# Altium schematic sheet POWER_VOLTAGE.SchDoc
size B
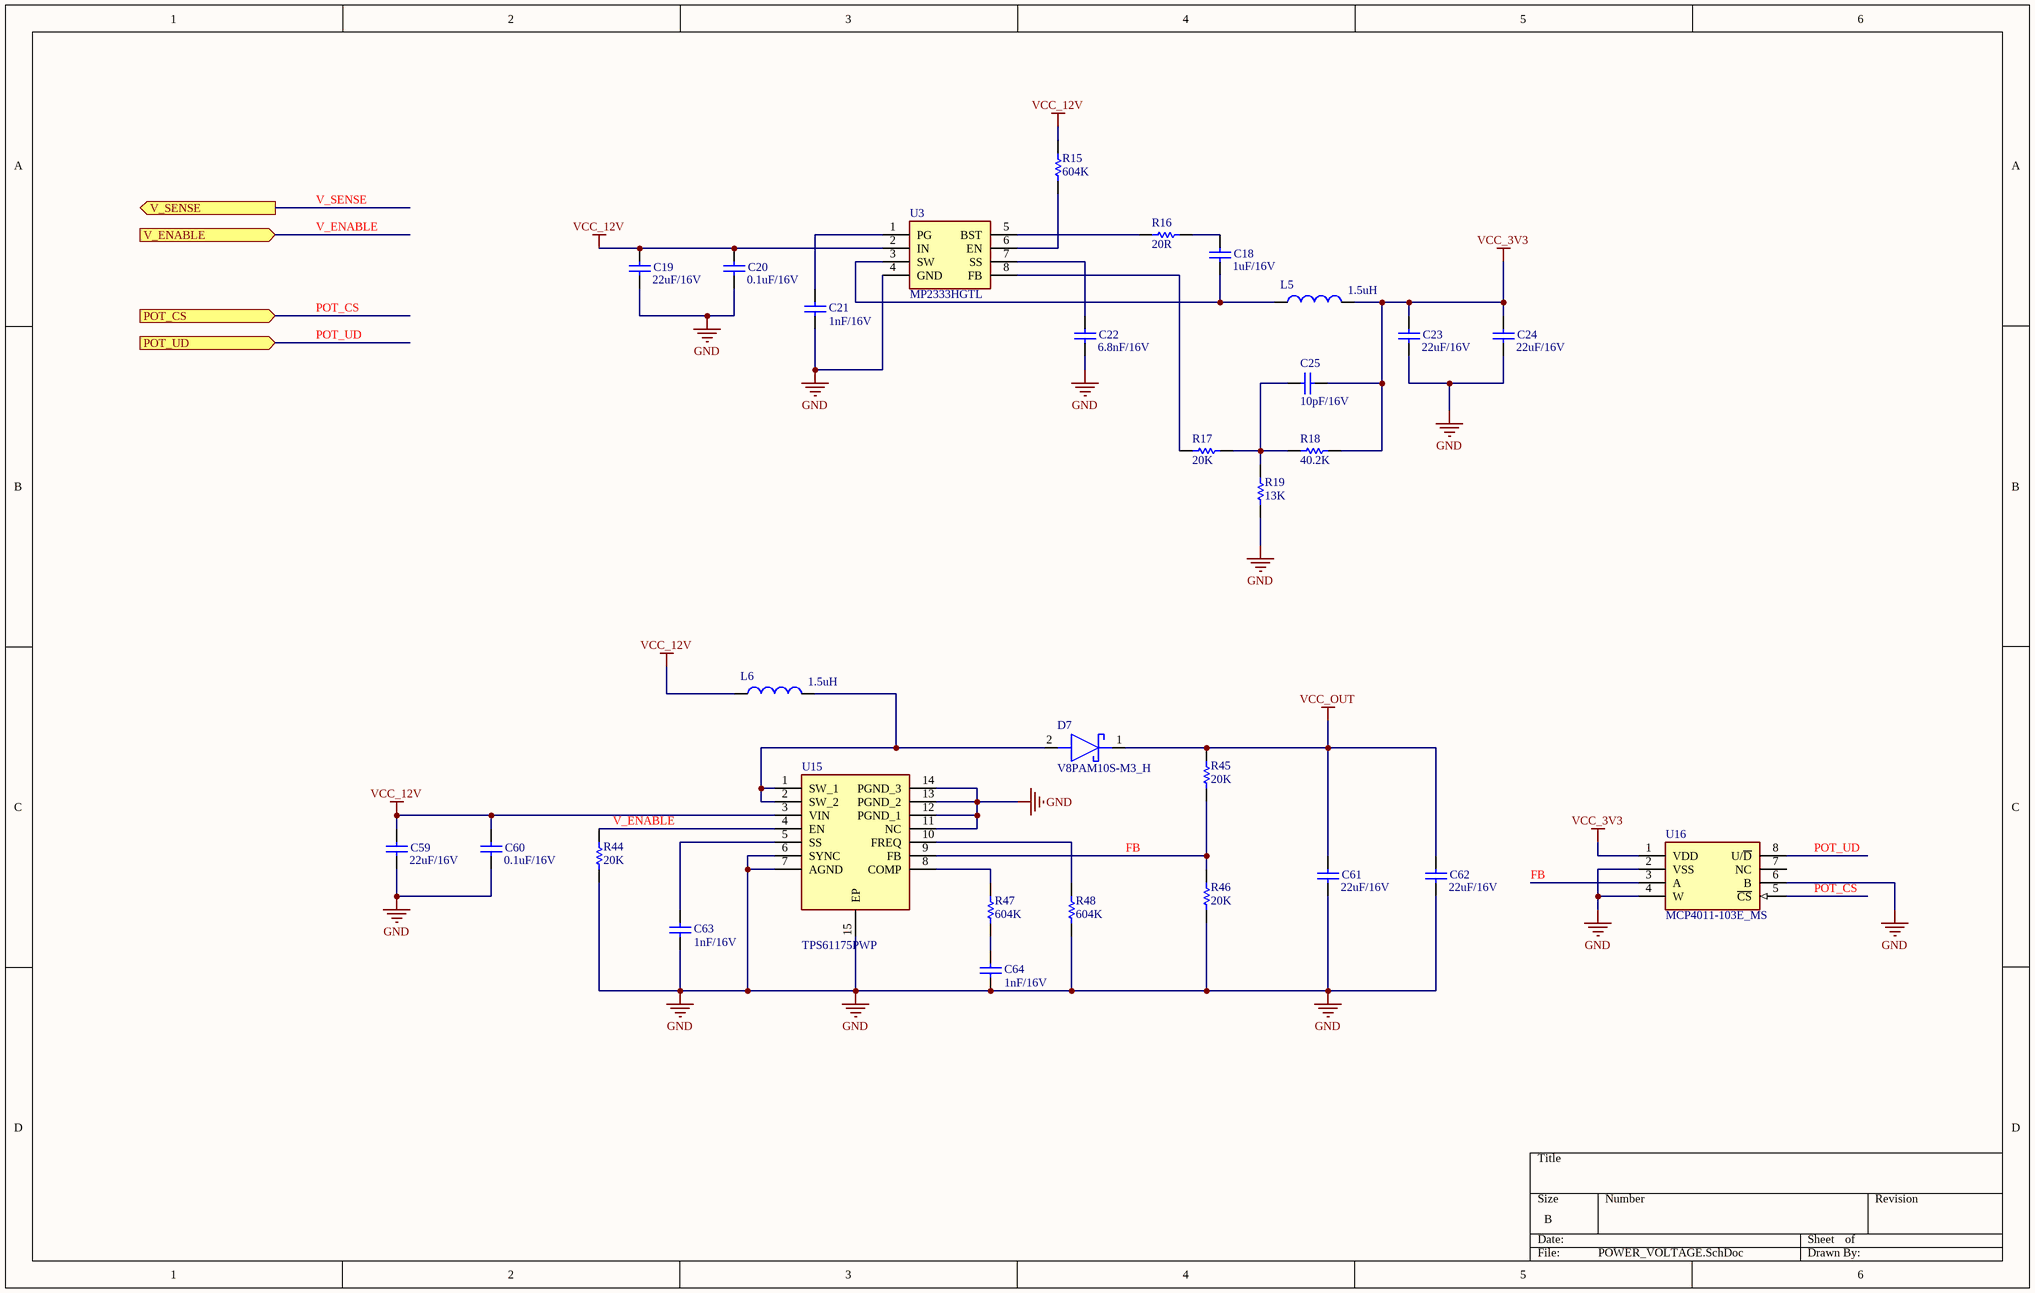
[diagram p0: POWER_VOLTAGE.SchDoc]

## Parts
C18  1uF/16V  [RAD-0.3]
C19  22uF/16V  [RAD-0.3]
C20  0.1uF/16V  [RAD-0.3]
C21  1nF/16V  [RAD-0.3]
C22  6.8nF/16V  [RAD-0.3]
C23  22uF/16V  [RAD-0.3]
C24  22uF/16V  [RAD-0.3]
C25  10pF/16V  [RAD-0.3]
C59  22uF/16V  [RAD-0.3]
C60  0.1uF/16V  [RAD-0.3]
C61  22uF/16V  [RAD-0.3]
C62  22uF/16V  [RAD-0.3]
C63  1nF/16V  [RAD-0.3]
C64  1nF/16V  [RAD-0.3]
D7  V8PAM10S-M3_H  [V8PAM10SHM3H]
L5  1.5uH
L6  1.5uH
R15  604K  [AXIAL-0.3]
R16  20R  [AXIAL-0.3]
R17  20K  [AXIAL-0.3]
R18  40.2K  [AXIAL-0.3]
R19  13K  [AXIAL-0.3]
R44  20K  [AXIAL-0.3]
R45  20K  [AXIAL-0.3]
R46  20K  [AXIAL-0.3]
R47  604K  [AXIAL-0.3]
R48  604K  [AXIAL-0.3]
U3  MP2333HGTL  [SOTFL50P160X60-8N]
U15  TPS61175PWP  [SOP65P640X120-15N]
U16  MCP4011-103E_MS  [SOP65P490X110-8N]

## Ports
POT_CS (in), POT_UD (in), V_ENABLE (in), V_SENSE (out)

## Nets
GND: C19.1 C20.1 C21.1 C22.1 C23.1 C24.1 C59.1 C60.1 C61.1 C62.1 C63.1 C64.1 R19.2 R44.2 R46.2 R48.1 U3.4(GND) U15.6(SYNC) U15.7(AGND) U15.11(NC) U15.12(PGND_1) U15.13(PGND_2) U15.14(PGND_3) U15.15(EP) U16.2(VSS) U16.4(W) U16.6(B)
VCC_3V3: C23.2 C24.2 C25.1 L5.2 R18.2 U16.1(VDD)
VCC_12V: C19.2 C20.2 C59.2 C60.2 L6.1 R15.2 U3.2(IN) U15.3(VIN)
VCC_OUT: C61.2 C62.2 D7.1(K) R45.1
FB: R45.2 R46.1 U15.9(FB) U16.3(A)
POT_CS: U16.5(~{CS}) ; port POT_CS
POT_UD: U16.8(U/~{D}) ; port POT_UD
V_ENABLE: R44.1 U15.4(EN) ; port V_ENABLE
V_SENSE: port V_SENSE
NetC18_1: C18.1 L5.1 U3.3(SW)
NetC18_2: C18.2 R16.2
NetC21_2: C21.2 U3.1(PG)
NetC22_2: C22.2 U3.7(SS)
NetC25_2: C25.2 R17.1 R18.1 R19.1
NetC63_2: C63.2 U15.5(SS)
NetC64_2: C64.2 R47.1
NetD7_2: D7.2(A) L6.2 U15.1(SW_1) U15.2(SW_2)
NetR15_1: R15.1 U3.6(EN)
NetR16_1: R16.1 U3.5(BST)
NetR17_2: R17.2 U3.8(FB)
NetR47_2: R47.2 U15.8(COMP)
NetR48_2: R48.2 U15.10(FREQ)

Not connected (* = marked no-connect by the designer): U16 7(NC)

## Library data of the parts
C18-C25 C59-C64 = Cap: Capacitor; Published: 8-Jun-2000; LatestRevisionDate: 17-Jul-2002; LatestRevisionNote: Re-released for DXP Platform.; PackageReference: RAD-0.3; Publisher: Altium Limited; PackageDescription: Radial Cap, Thru-Hole; 2 Leads; 0.3 in Pin Spacing
  C18: Value: 1uF/16V
  C19 C23 C24 C59 C61 C62: Value: 22uF/16V
  C20 C60: Value: 0.1uF/16V
  C21 C63 C64: Value: 1nF/16V
  C22: Value: 6.8nF/16V
  C25: Value: 10pF/16V
D7 = V8PAM10S-M3_H: Schottky Diode; Manufacturer_Name: Vishay; Manufacturer_Part_Number: V8PAM10S-M3/H; Datasheet Link: https://www.vishay.com/docs/87013/v8pam10s.pdf; Height: 1mm; Mouser Part Number: 78-V8PAM10S-M3/H; Mouser Price/Stock: https://www.mouser.co.uk/ProductDetail/Vishay-General-Semiconductor/V8PAM10S-M3-H?qs=7MVldsJ5Uazp%2FkF6tV7Ktw%3D%3D
L5 L6 = INDUCTOR: Fixed Inductors .33uH 20%; Manufacturer: Vishay; Mfr Part No: IHLP1212ABEVR33M5A; Stockiest Part No: 70-IHLP1212ABVR33M5A; Value: 1.5uH; Stockiest: MOUSER
R15-R19 R44-R48 = Res1: Resistor; Published: 8-Jun-2000; LatestRevisionDate: 17-Jul-2002; LatestRevisionNote: Re-released for DXP Platform.; PackageReference: AXIAL-0.3; Publisher: Altium Limited; PackageDescription: Axial Device, Thru-Hole; 2 Leads; 0.3 in Pin Spacing
  R15 R47 R48: Value: 604K
  R16: Value: 20R
  R17 R44-R46: Value: 20K
  R18: Value: 40.2K
  R19: Value: 13K
U3 = MP2333HGTL: Integrated Circuit; Manufacturer_Name: Monolithic Power Systems (MPS); Datasheet Link: https://4donline.ihs.com/images/VipMasterIC/IC/MONO/MONO-S-A0008397207/MONO-S-A0008397207-1.pdf?hkey=EF798316E3902B6ED9A73243A3159BB0; Height: 0.6mm; Manufacturer_Part_Number: MP2333HGTL
U15 = TPS61175PWP: Integrated Circuit; Manufacturer_Name: Texas Instruments; Datasheet Link: http://docs-emea.rs-online.com/webdocs/0e32/0900766b80e32258.pdf; Height: 1.2mm; Manufacturer_Part_Number: TPS61175PWP; Arrow Part Number: TPS61175PWP; Arrow Price/Stock: https://www.arrow.com/en/products/tps61175pwp/texas-instruments; Mouser Part Number: 595-TPS61175PWP; Mouser Price/Stock: https://www.mouser.co.uk/ProductDetail/Texas-Instruments/TPS61175PWP?qs=7IaIRco65pkcG6%252BABCkf6A%3D%3D
U16 = MCP4011-103E_MS: Integrated Circuit; Manufacturer_Name: Microchip; Manufacturer_Part_Number: MCP4011-103E/MS; Datasheet Link: http://docs-emea.rs-online.com/webdocs/0d2a/0900766b80d2a9fb.pdf; Height: 1.1mm; Arrow Part Number: MCP4011-103E/MS; Arrow Price/Stock: https://www.arrow.com/en/products/mcp4011-103ems/microchip-technology; Mouser Part Number: 579-MCP4011-103E/MS; Mouser Price/Stock: https://www.mouser.co.uk/ProductDetail/Microchip-Technology/MCP4011-103E-MS?qs=usxtMOJb1RxX526ZmX1Hjw%3D%3D